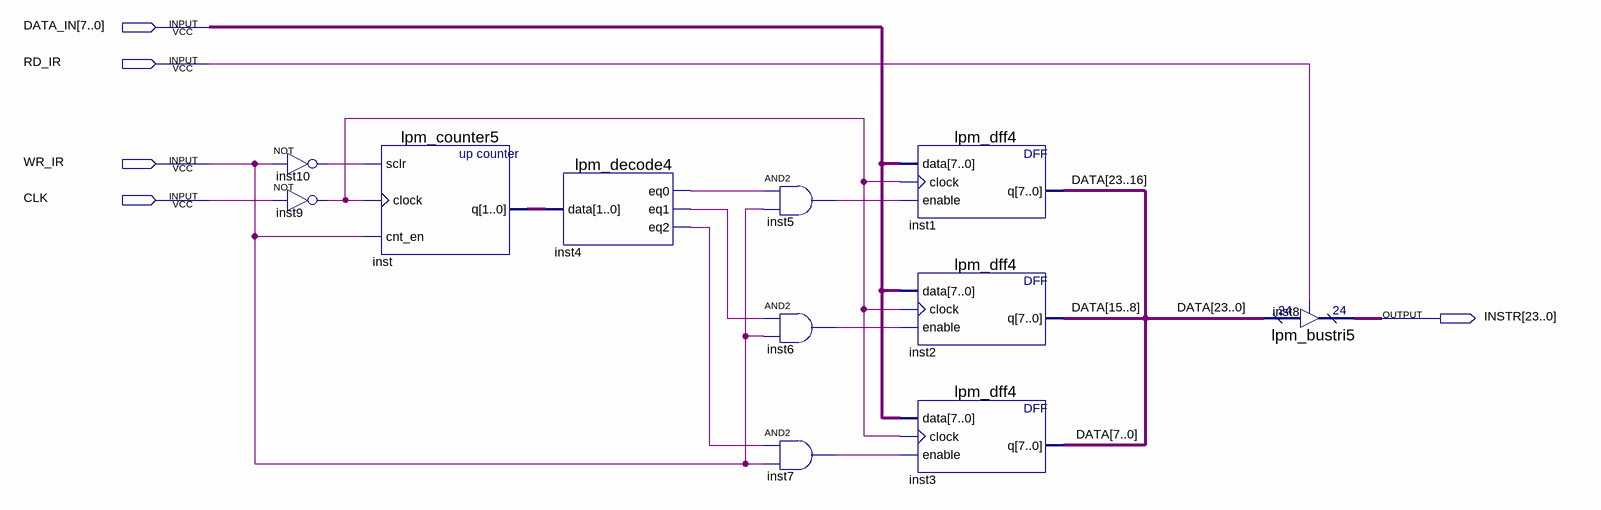
[diagram p0: schematic sheet]
// Quartus schematic IR.bdf as structural Verilog: 11 symbols, 5 pins
module IR (
  input  [7:0] DATA_IN,
  input  RD_IR,
  input  WR_IR,
  input  CLK,
  output [23:0] INSTR
);

  wire inst4_eq0, inst4_eq1, inst4_eq2, inst5_out, inst6_out, inst7_out, inst9_out, inst10_out;
  wire [1:0] inst_q;
  wire [23:0] DATA;

  not inst10 (inst10_out, WR_IR);
  not inst9 (inst9_out, CLK);
  lpm_counter5 inst (.sclr(inst10_out), .clock(inst9_out), .cnt_en(WR_IR), .q(inst_q));
  lpm_decode4 inst4 (.data(inst_q), .eq0(inst4_eq0), .eq1(inst4_eq1), .eq2(inst4_eq2));
  and inst5 (inst5_out, inst4_eq0, WR_IR);
  and inst6 (inst6_out, inst4_eq1, WR_IR);
  and inst7 (inst7_out, inst4_eq2, WR_IR);
  lpm_dff4 inst1 (.data(DATA_IN), .clock(inst9_out), .enable(inst5_out), .q(DATA[23:16]));
  lpm_dff4 inst2 (.data(DATA_IN), .clock(inst9_out), .enable(inst6_out), .q(DATA[15:8]));
  lpm_dff4 inst3 (.data(DATA_IN), .clock(inst9_out), .enable(inst7_out), .q(DATA[7:0]));
  lpm_bustri5 inst8 (.enabledt(RD_IR), .data(DATA), .tridata(INSTR));
endmodule
